# Altium project SpeakEasy_Power.PrjPcb
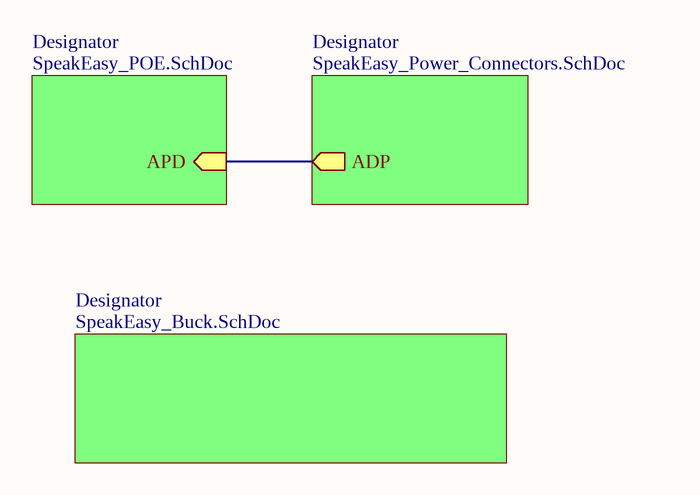
[diagram p0: SpeakEasy_Power.SchDoc]
4 sheets, 38 parts. Net scope: hierarchical (ports join the sheet entries above them; power ports are global).
Board file: SpeakEasy_Power.PcbDoc
Sheets:
  SpeakEasy_Power.SchDoc
    Designator = SpeakEasy_POE.SchDoc
    Designator = SpeakEasy_Power_Connectors.SchDoc
    Designator = SpeakEasy_Buck.SchDoc

## Sheet SpeakEasy_Power.SchDoc
size A

### Sub-sheets
Designator = SpeakEasy_POE.SchDoc: APD (in)
Designator = SpeakEasy_Power_Connectors.SchDoc: ADP (out)
Designator = SpeakEasy_Buck.SchDoc: no entries

### Nets
ADP: sheet Designator/APD, sheet Designator/ADP

## Sheet SpeakEasy_POE.SchDoc
size A
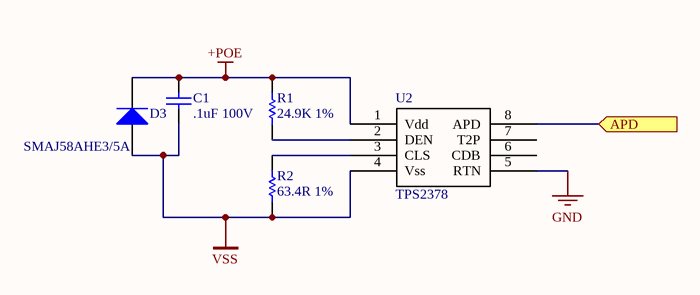
[diagram p1: SpeakEasy_POE.SchDoc]

### Parts
C1  .1uF 100V  [CAPC0603(1608)100_L]
D3  SMAJ58AHE3/5A  [VISH-DO-214AC-2_M]
R1  24.9K 1%  [RESC0603(1608)_L]
R2  63.4R 1%  [RESC0603(1608)_L]
U2  TPS2378  [8SOPWR]

### Ports
APD (in)

### Nets
+POE: C1.1 D3.1(K) R1.2 U2.1(Vdd)
GND: U2.5(RTN)
VSS: C1.2 D3.2(A) R2.1 U2.4(Vss)
ADP: U2.8(APD) ; port APD
NetR1_1: R1.1 U2.2(DEN)
NetR2_2: R2.2 U2.3(CLS)

Not connected (* = marked no-connect by the designer): U2 6(CDB) 7(T2P)

### Library data of the parts
C1 = CMP-1590-00005-1: 0.1µF ±10% 100V Ceramic Capacitor X7S 0603 (1608 Metric); Case-Metric: 1608; Case-EIA: 0603; PackageReference: CAPC0603(1608)100
D3 = CMP-0548-00176-1: Transient Voltage Suppressor, 6.40 to 231 V, 58 V Stand-off Voltage, Uni-Directional, -55 to 155 degC, 2-pin DO-214AC, Pb-Free, Tape and Reel; Manufacturer: Vishay Semiconductor; VWM (V): 58; PPPM (W): 400, 300; ID (uA): 1; VBR Uni-Directional (V): 6.4 to 231; IFSM: 40 A; ComponentLink2URL: http://www.vishay.com/docs/88390/smaj50a.pdf; Operating Junction and Storage Temperature Range: -55 to 150 degC; RoHS: TRUE; PackageReference: DO-214AC-2; PackageDescription: 2-Pin DO-214AC (SMA), Body 4.245 x 2.665 mm; ComponentLink1URL: http://www.vishay.com/; PartNumber: SMAJ58AHE3/5A; ComponentLink3Description: Package Specification; ComponentLink3URL: http://www.vishay.com/docs/88390/smaj50a.pdf; Packing: Tape and Reel; Mounting Technology: Surface Mount; DatasheetVersion: 12/8/2013; ComponentLink1Description: Manufacturer URL; ComponentLink2Description: Datasheet
R1 R2 = CMP-1591-00001-1: 0603 (1608 Metric) Chip Resistor; Case-Metric: 1608; Case-EIA: 0603; PackageReference: RESC0603(1608)
U2 = TPS2378: POE Manager IC; ComponentLink1Description: Datasheet; ComponentLink1URL: http://www.ti.com/lit/ds/symlink/tps2378.pdf

## Sheet SpeakEasy_Power_Connectors.SchDoc
size A
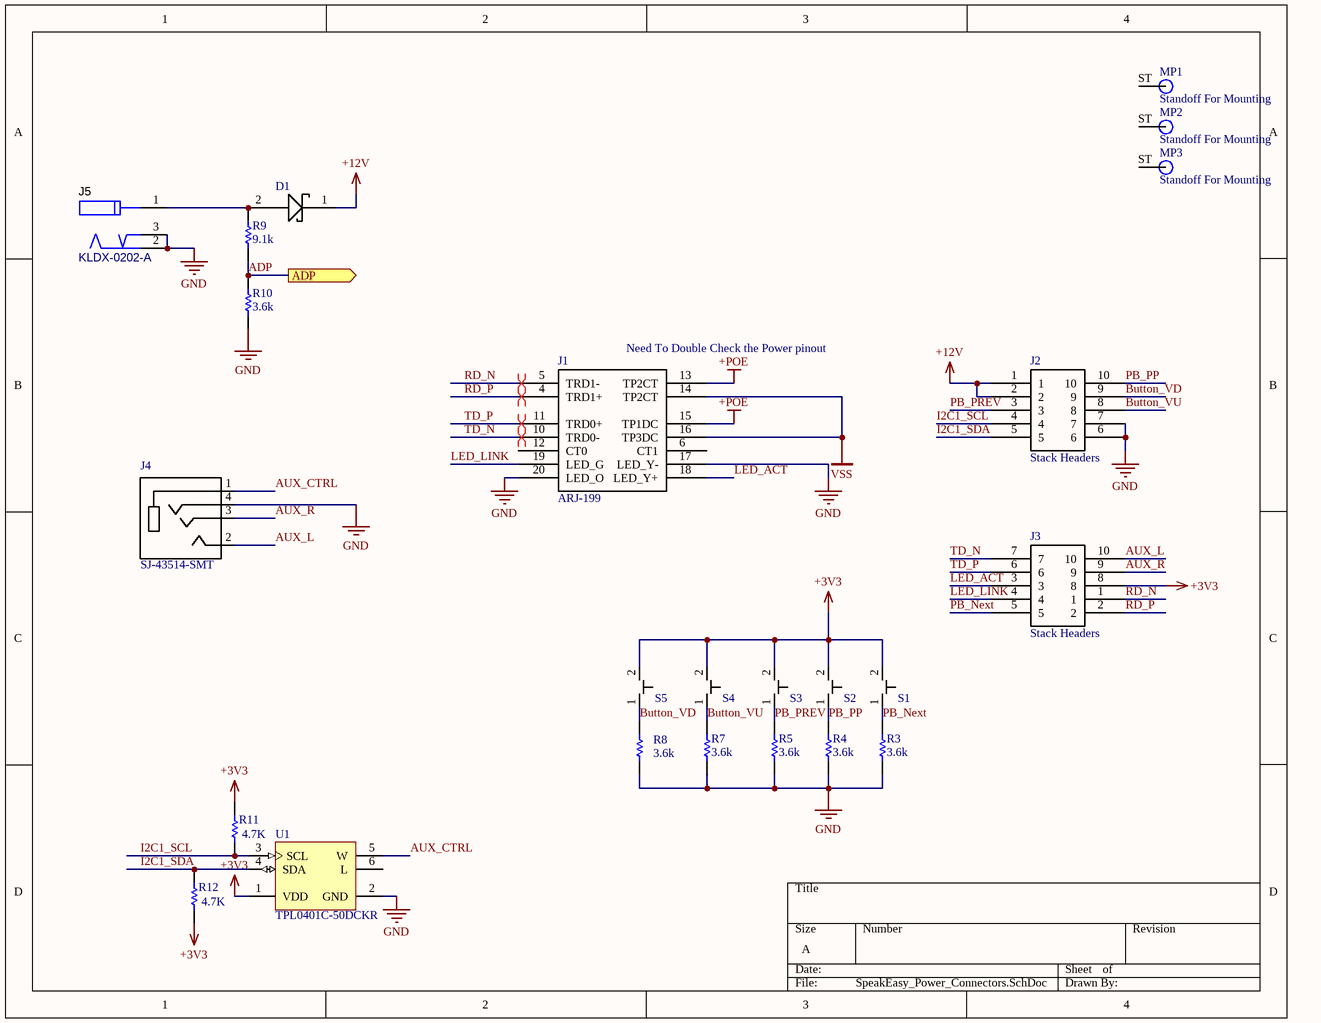
[diagram p2: SpeakEasy_Power_Connectors.SchDoc]

### Parts
D1  Shottkey Diode  [DO-220AA]  (value not drawn)
J1  ARJ-199  [ARJ-199]
J2  Stack Headers  [TSW-105]
J3  Stack Headers  [TSW-105]
J4  SJ-43514-SMT  [CUI_SJ-43514-SMT]
J5  KLDX-0202-A  [KYCN-KLDX-0202-A_V]
MP1  Standoff For Mounting  [STO]
MP2  Standoff For Mounting  [STO]
MP3  Standoff For Mounting  [STO]
R3  3.6k  [RESC0805(2012)_L]
R4  3.6k  [RESC0805(2012)_L]
R5  3.6k  [RESC0805(2012)_L]
R7  3.6k  [RESC0805(2012)_L]
R8  3.6k  [RESC0805(2012)_L]
R9  9.1k  [RESC0805(2012)_L]
R10  3.6k  [RESC0805(2012)_L]
R11  4.7k  [RESC0603(1608)_N]
R12  4.7K  [RESC0603(1608)_N]
S1  SPST Switch  [TL1105]  (value not drawn)
S2  SPST Switch  [TL1105]  (value not drawn)
S3  SPST Switch  [TL1105]  (value not drawn)
S4  SPST Switch  [TL1105]  (value not drawn)
S5  SPST Switch  [TL1105]  (value not drawn)
U1  TPL0401C-50DCKR  [TI-DCK6_V]

### Ports
ADP (out)

### Nets
+3V3: J3.8 R11.2 R12.1 S1.2 S2.2 S3.2 S4.2 S5.2 U1.1(VDD)
+12V: D1.1(-) J2.1 J2.2
+POE: J1.13(TP2CT) J1.15(TP1DC)
GND: J1.17(LED_Y-) J1.20(LED_O) J2.6 J2.7 J4.4(RING2) J5.2 J5.3 R3.2 R4.2 R5.2 R7.1 R8.1 R10.1 U1.2(GND)
VSS: J1.14(TP2CT) J1.16(TP3DC)
ADP: R9.1 R10.2 ; port ADP
AUX_CTRL: J4.1(SLEEVE) U1.5(W)
AUX_L: J3.10 J4.2(TIP)
AUX_R: J3.9 J4.3(RING1)
Button_VD: J2.9 R8.2 S5.1
Button_VU: J2.8 R7.2 S4.1
I2C1_SCL: J2.4 R11.1 U1.3(SCL)
I2C1_SDA: J2.5 R12.2 U1.4(SDA)
LED_ACT: J1.18(LED_Y+) J3.3
LED_LINK: J1.19(LED_G) J3.4
PB_Next: J3.5 R3.1 S1.1
PB_PP: J2.10 R4.1 S2.1
PB_PREV: J2.3 R5.1 S3.1
RD_N: J1.5(TRD1-) J3.1
RD_P: J1.4(TRD1+) J3.2
TD_N: J1.10(TRD0-) J3.7
TD_P: J1.11(TRD0+) J3.6
NetD1_2: D1.2(+) J5.1 R9.2

Not connected (* = marked no-connect by the designer): J1 6(CT1) 12(CT0); MP1 ST(1); MP2 ST(1); MP3 ST(1); U1 6(L)

### Layout directives
differential pair; differential pair class TX_DIFF; rule Matched Net Lengths [Tolerance = 20mil]: TD_N, TD_P
differential pair; differential pair class RX Diff; rule Matched Net Lengths [Tolerance = 20mil]: RD_N, RD_P

### Notes on the sheet
- (near J1) Need To Double Check the Power pinout

### Library data of the parts
D1 = V3P6: ComponentLink1Description: Datasheet; ComponentLink1URL: https://www.vishay.com/docs/89344/v3p6.pdf
J1 = ARJ-199: MagJack POE+ Jack
J2 J3 = Stack Headers: System: Connector
J5 = CMP-1673-00001-1: DC Power Connectors 2mm PCB JACK POWER JACK; ComponentLink1URL: http://www.mouser.com/ds/2/222/KLDX_0202_LT-334784.pdf; ComponentLink1Description: Datasheet; PackageReference: KLDX-0202-A; PartNumber: KLDX-0202-A
MP1-MP3 = Standoff
R3-R5 R7-R10 = CMP-1591-00002-1: 0805 (2012 Metric) Chip Resistor; Case-EIA: 0805; Case-Metric: 2012; PackageReference: RESC0805(2012)
R11 = CMP-1012-00122-1: 100K 0.1W 5% 0603 (1608 Metric)  SMD; Case-EIA: 0603; Case-Metric: 1608; Value: 4.7K; Tolerance: 5 %; Power: 0.1 W; Technology: SMT
R12 = CMP-1012-00122-1: Case-EIA: 0603; Tolerance: 5 %; Power: 0.1 W; Case-Metric: 1608; Value: 4.7K; Technology: SMT
U1 = CMP-0004-00347-1: 128 Tap Digital Potentiometer with I2C Interface, -40 to 125 degC, 6-pin SOT23 (DCK6); Manufacturer: Texas Instruments; INL(Max)(+/-LSB): 0.5; DNL(Max)(+/-LSB): 0.25; Settling Time(us): 0.152; Interface: I2C; PackageReference: DCK6; Code_JEDEC: MO-203; ComponentLink2Description: Datasheet; SubFamily: Digital Potentiometer; ComponentLink3URL: http://www.ti.com/litv/pdf/mpds114c; PackageDescription: 6-Pin Plastic Small Outline, Body 2 x 1.25 mm, Pitch 0.65 mm; ComponentLink3Description: Package Specification; Mounting Technology: Surface Mount; PackageVersion: 4093553-4/G, 01/2007; PartNumber: TPL0401C-50DCKR; ComponentLink2URL: http://www.ti.com/general/docs/lit/getliterature.tsp?genericPartNumber=TPL0401C-50&fileType=pdf; DatasheetVersion: SLIS144A; ComponentLink1URL: http://www.ti.com/; ComponentLink1Description: Manufacturer URL
J4 = SJ-43514-SMT: Value: *

## Sheet SpeakEasy_Buck.SchDoc
size A
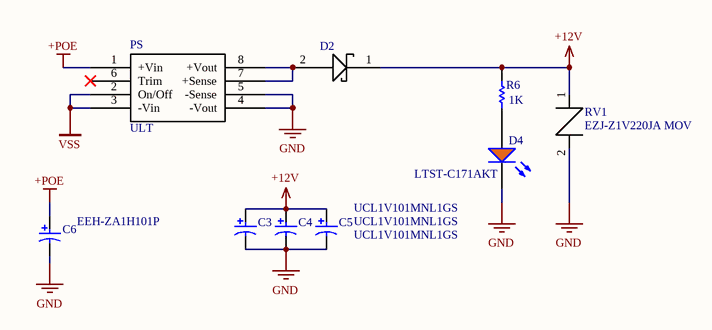
[diagram p3: SpeakEasy_Buck.SchDoc]

### Parts
C3  UCL1V101MNL1GS  [NIC-UCL1V101MNL1GS_L]
C4  UCL1V101MNL1GS  [NIC-UCL1V101MNL1GS_L]
C5  UCL1V101MNL1GS  [NIC-UCL1V101MNL1GS_L]
C6  EEH-ZA1H101P  [PNSC-ZA-G_L]
D2  Shottkey Diode  [DO-220AA]  (value not drawn)
D4  LTST-C171AKT  [LTST-C171AKT_V]
PS  ULT  [ULT-12/2.5]
R6  1k  [RESC0603(1608)_N]
RV1  EZJ-Z1V220JA MOV  [DIOC1608X06N]

### Nets
+12V: C3.1 C4.1 C5.1 D2.1(-) R6.2 RV1.1
+POE: C6.1 PS.1(+Vin)
GND: C3.2 C4.2 C5.2 C6.2 D4.C PS.4(-Vout) PS.5(-Sense) RV1.2
VSS: PS.2(On/Off) PS.3(-Vin)
NetD2_2: D2.2(+) PS.7(+Sense) PS.8(+Vout)
NetD4_A: D4.A R6.1

Not connected (* = marked no-connect by the designer): PS 6(Trim)*

### Library data of the parts
C3-C5 = CMP-2000-07344-1: Aluminum Electrolytic Capacitor, 100 uF, 35 V, 20%, -55 to 105 degC, 2-Pin SMD, RoHS, Tape and Reel; Manufacturer: Nichicon; Capacitance: 100uF; Dissipation Factor DF: 0.12; Case Diameter: 8mm; Ripple Current: 850mA; Type: AluminumElectrolyticCapacitors,ChipType,LowImpedance; Case Height: 8.3mm; Leakage Current: 3uA; Voltage Rating DC: 35V; Load Life: 2000h; Case Length: 10mm; Series: CL; Minimum Operating Temperature: -55C; Datasheet URL: http://datasheet.octopart.com/UCL1V101MNL1GS-Nichicon-datasheet-41194108.pdf; Manufacturer URL: http://www.nichicon.co.jp/english/; Maximum Operating Temperature: +105C; Package Reference: UCL1V101MNL1GS; Operating Temperature Range: -55Cto+105C; Brand: Nichicon; Package Description: 2-Pin Surface Mount Device, Body 8.3 x 8.3 mm, Height 10.8 mm; RoHS: Details; Voltage Rating: 35V; Dimensions: 8mmDia.x10mmLx8.3mmH; Termination Style: SMD/SMT; Datasheet Version: 01/2015; Packaging: Reel; Mounting Technology: SurfaceMount; Product Category: AluminumElectrolyticCapacitors-SMD; Factory Pack Quantity: 500; Product: LowImpedanceElectrolyticCapacitors; Tolerance: 20%
C6 = CMP-2000-06221-1: Conductive Polymer Hybrid Aluminum Electrolytic Capacitor, 100 uF, +/- 20%, 50 V, -55 to 105 degC, 2-Pin SMD (G), RoHS, Tape and Reel; Case Height: 10.5mm; Voltage Rating DC: 50V; Case Diameter: 10mm; Ripple Current: 2A; Load Life: 10000Hour; Brand: Panasonic; Case Length: 10.2mm; ESR: 28mOhms; Capacitance: 100uF; Manufacturer URL: http://www.panasonic.com/; Minimum Operating Temperature: -55C; Datasheet Version: 06/2016; Product Category: AluminumOrganicPolymerCapacitors; Maximum Operating Temperature: +105C; Package Description: 2-Pin Surface Mount Device, Body 10.3 x 10.3 mm; Package Reference: ZA-G; RoHS: Details; Series: ZA; Tolerance: 20%; Product: AluminumElectrolyticCapacitors; Factory Pack Quantity: 500; Manufacturer: Panasonic; Termination Style: SMD/SMT; Datasheet URL: https://industrial.panasonic.com/cdbs/www-data/pdf/RDD0000/DMD0000COL56.pdf; Mounting Technology: SurfaceMount; Packaging: Reel; Height: 10.5mm
D2 = V3P6: ComponentLink1Description: Datasheet; ComponentLink1URL: https://www.vishay.com/docs/89344/v3p6.pdf
D4 = CMP-1674-00004-3: LED AMBER CLR THIN 0805 SMD; Manufacturer: Lite-On; PartNumber: LTST-C171AKT; ComponentLink1URL: http://optoelectronics.liteon.com/upload/download/DS-22-99-0170/S_110_LTST-C171AKT.pdf; PackageReference: C171AKT; ComponentLink1Description: Datasheet
PS = ULT: +12V/2.5A DC/DC Converter, requires 36-75V input to power on.; ComponentLink1Description: Datasheet; ComponentLink1URL: https://power.murata.com/data/power/ult.pdf
R6 = CMP-1012-00122-1: as R12 on sheet SpeakEasy_Power_Connectors; Value: 1K; Technology: SMT
RV1 = EZJ-Z1V220JA: Voltage Supression; ComponentLink1Description: Datasheet; ComponentLink1URL: https://industrial.panasonic.com/cdbs/www-data/pdf/AWC0000/AWC0000C55.pdf

## Nets that join several sheets
+12V: SpeakEasy_Power_Connectors (D1.1 J2.1 J2.2), SpeakEasy_Buck (6 pins)
+POE: SpeakEasy_POE (C1.1 D3.1 R1.2 U2.1), SpeakEasy_Power_Connectors (J1.13 J1.15), SpeakEasy_Buck (C6.1 PS.1)
GND: SpeakEasy_POE (U2.5), SpeakEasy_Power_Connectors (14 pins), SpeakEasy_Buck (8 pins)
VSS: SpeakEasy_POE (C1.2 D3.2 R2.1 U2.4), SpeakEasy_Power_Connectors (J1.14 J1.16), SpeakEasy_Buck (PS.2 PS.3)
ADP: SpeakEasy_POE (U2.8), SpeakEasy_Power_Connectors (R9.1 R10.2)